# Altium schematic sheet EEPROM.SchDoc: EEPROM
size A4; DocumentNumber: 5; SheetNumber: 5; SheetTotal: 18
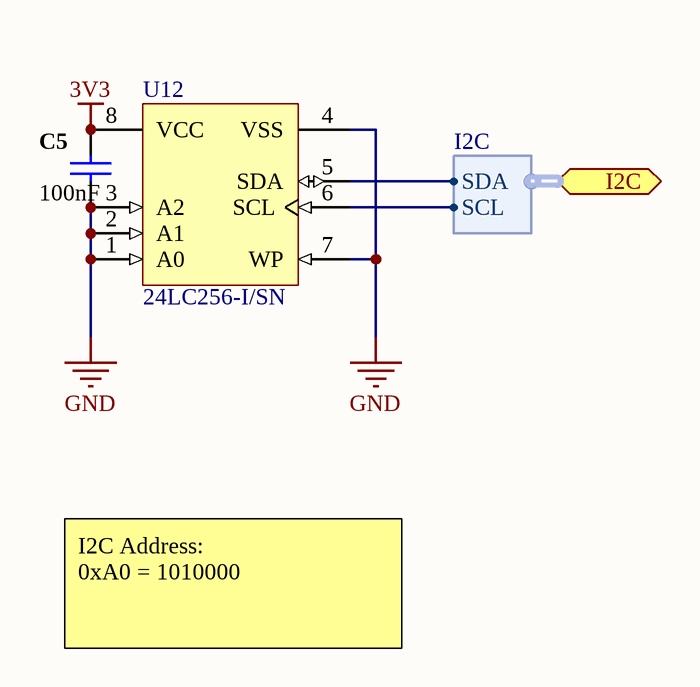
[diagram p0: EEPROM.SchDoc]

## Parts
C5  100nF  [0805C-GENERIC]
U12  24LC256-I/SN  [SOIC-SN8_L]

## Ports
I2C (harness I2C)

## Harnesses
I2C: SDA, SCL

## Nets
3V3: C5.1 U12.8(VCC)
GND: C5.2 U12.1(A0) U12.2(A1) U12.3(A2) U12.4(VSS) U12.7(WP)
NetU12_5: U12.5(SDA) ; port I2C.SDA
NetU12_6: U12.6(SCL) ; port I2C.SCL

## Notes on the sheet
- I2C Address:
  0xA0 = 1010000
- Title
- Size:
- Date:
- A4
- Number:
- Time:
- Revision:
- Sheet
- of
- File:

## Library data of the parts
C5 = D-101-0027: Capacitor, Ceramic, 10% 10V 0805 X7R; Polarity: Non-Polarized; Capacitance: 100nF; Dielectric: X7R; Mounting Technology: Surface Mount; Rated Voltage: 10 V; Status: Production; Technology: Ceramic; Tolerance: 10 %; Category: Capacitor
U12 = 24LC256-I/SN: 256Kbit, 400kHz, 2.5V, I2C Serial EEPROM, 8-Pin SOIC 150mil, Industrial Temperature; Manufacturer: Microchip; DatasheetVersion: revP, Oct-2007; PackageVersion: revBB, Aug-2009; PackageReference: SOIC-SN8; PackageDescription: 8-Lead Plastic Small Outline (SN) - Narrow, 3.90mm Body [SOIC]; Supplier 1: Digi-Key; Supplier Part Number 1: 24LC256-I/SN-ND; Supplier 2: Farnell; Supplier Part Number 2: 9757996; Supplier 3: Farnell; Supplier Part Number 3: 1660005; Supplier 4: Newark; Supplier Part Number 4: 27C9144; Supplier 5: Mouser; Supplier Part Number 5: 579-24LC256-I/SN; Mounting Technology: Surface Mount; Code_JEDEC: MS-012; Code_IPC: SOIC127P600-8; PartNumber: 24LC256-I/SN; ComponentLink1Description: Manufacturer URL; ComponentLink1URL: http://www.microchip.com/; ComponentLink2Description: Datasheet; ComponentLink2URL: http://ww1.microchip.com/downloads/en/DeviceDoc/21203P.pdf; ComponentLink3Description: Package Specification; ComponentLink3URL: http://www.microchip.com/stellent/groups/techpub_sg/documents/packagingspec/en012702.pdf